# EAGLE design placa_nano (EAGLE 7.7.0)
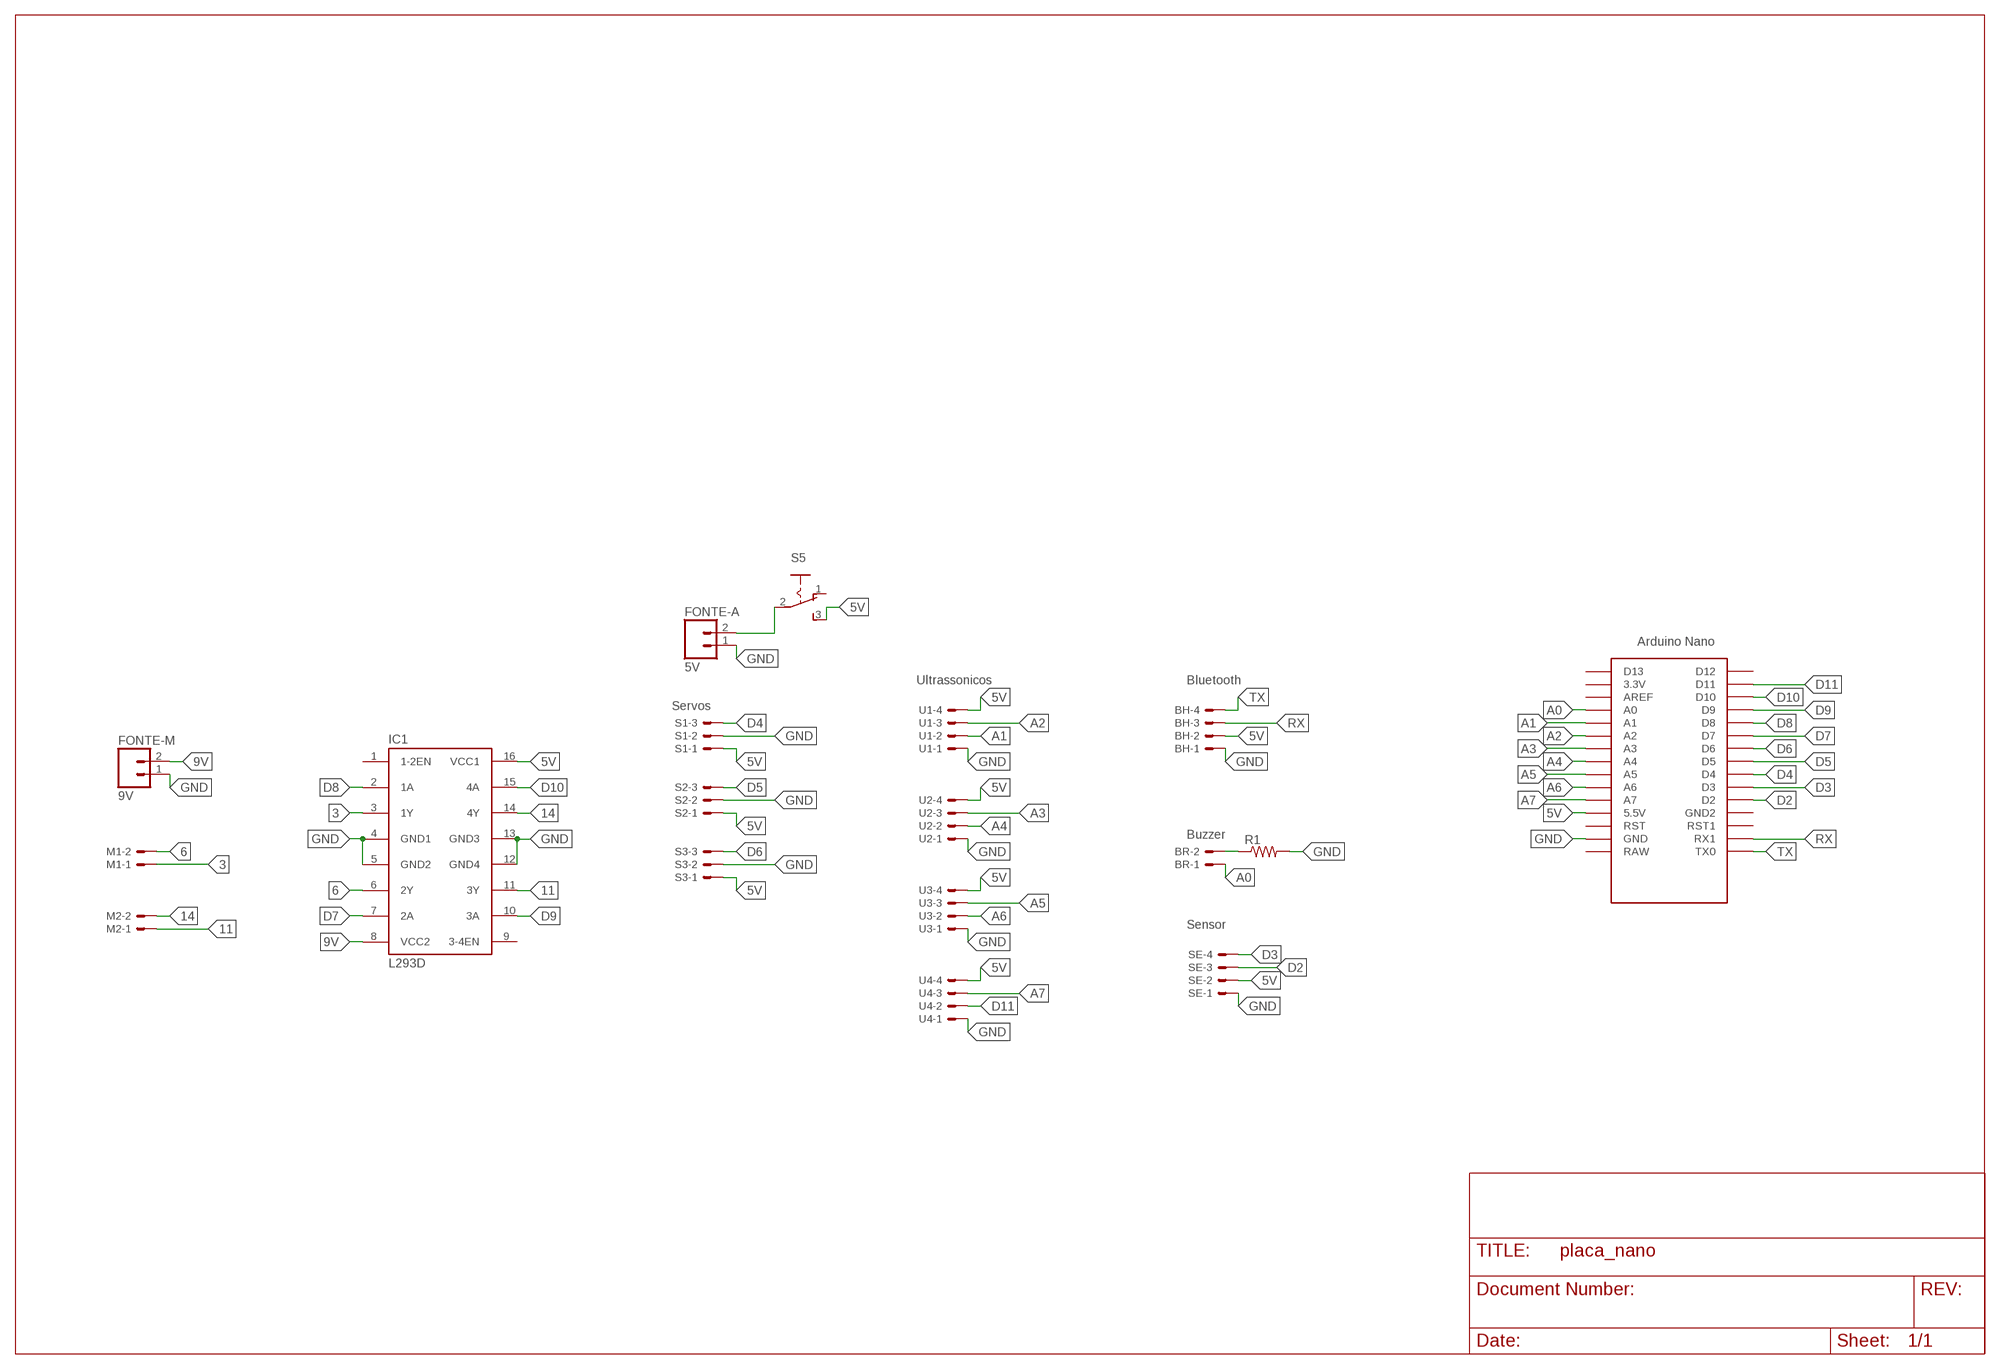
[diagram p0: schematic, sheet 1]

## Parts
BH  22-23-2041  [22-23-2041]
BR  22-23-2021  [22-23-2021]
FONTE-A  5V  M02  [02P]
FONTE-M  9V  M02  [02P]
IC1  L293D  [DIL16]
M1  22-23-2021  [22-23-2021]
M2  22-23-2021  [22-23-2021]
R1  R-US_0207/10  [0207/10]
S1  22-23-2031  [22-23-2031]
S2  22-23-2031  [22-23-2031]
S3  22-23-2031  [22-23-2031]
S5  255SB  [255SB]
SE  22-23-2041  [22-23-2041]
U1  22-23-2041  [22-23-2041]
U2  22-23-2041  [22-23-2041]
U3  22-23-2041  [22-23-2041]
U4  22-23-2041  [22-23-2041]
U$1  NANO  [NANO]

## Nets
3: IC1.3(1Y) M1.1
5V: BH.2 FONTE-A.2 IC1.16(VCC1) S1.1 S2.1 S3.1 S5.2(P) S5.3(S) SE.2 U1.4 U2.4 U3.4 U4.4 U$1.5V(5.5V)
6: IC1.6(2Y) M1.2
9V: FONTE-M.2 IC1.8(VCC2)
11: IC1.11(3Y) M2.1
14: IC1.14(4Y) M2.2
A0: BR.1 U$1.A0
A1: U1.2 U$1.A1
A2: U1.3 U$1.A2
A3: U2.3 U$1.A3
A4: U2.2 U$1.A4
A5: U3.3 U$1.A5
A6: U3.2 U$1.A6
A7: U4.3 U$1.A7
D2: SE.3 U$1.D2
D3: SE.4 U$1.D3
D4: S1.3 U$1.D4
D5: S2.3 U$1.D5
D6: S3.3 U$1.D6
D7: IC1.7(2A) U$1.D7
D8: IC1.2(1A) U$1.D8
D9: IC1.10(3A) U$1.D9
D10: IC1.15(4A) U$1.D10
D11: U4.2 U$1.D11
GND: BH.1 FONTE-A.1 FONTE-M.1 IC1.4(GND1) IC1.5(GND2) IC1.12(GND4) IC1.13(GND3) R1.2 S1.2 S2.2 S3.2 SE.1 U1.1 U2.1 U3.1 U4.1 U$1.GND
N$4: BR.2 R1.1
RX: BH.3 U$1.RX1
TX: BH.4 U$1.TX0
Unconnected: IC1.1(1-2EN) IC1.9(3-4EN) S5.1(O) U$1.3.3V U$1.AREF U$1.D12 U$1.D13 U$1.GND1(GND2) U$1.RAW U$1.RST U$1.RST1

## Notes on the sheet
- Ultrassonicos | Bluetooth
- Servos
- Buzzer
- Sensor

## Library data of the parts
BH SE U1-U4 = con-molex:22-23-2041: .100" (2.54mm) Center Header - 4 Pin; MF: MOLEX; MPN: 22-23-2041; OC_FARNELL: 1462920; OC_NEWARK: 38C0355
BR M1 M2 = con-molex:22-23-2021: .100" (2.54mm) Center Header - 2 Pin; MF: MOLEX; MPN: 22-23-2021; OC_FARNELL: 1462926; OC_NEWARK: 25C3832
FONTE-A FONTE-M = con-amp-quick:M02: AMP QUICK CONNECTOR; OC_FARNELL: unknown; OC_NEWARK: unknown
IC1 = st-microelectronics:L293D: PUSH-PULL 4 CHANNEL DRIVER; MPN: L293D; OC_FARNELL: 9589619; OC_NEWARK: 56P8249
R1 = resistor:R-US_: RESISTOR, American symbol
S1-S3 = con-molex:22-23-2031: .100" (2.54mm) Center Header - 3 Pin; MF: MOLEX; MPN: 22-23-2031; OC_FARNELL: 1462950; OC_NEWARK: 30C0862
S5 = switch:255SB: SLIDING SWITCH Distributor Buerklin, 11G810
U$1 = Arduino-clone:NANO: Arduino Nano

## Board
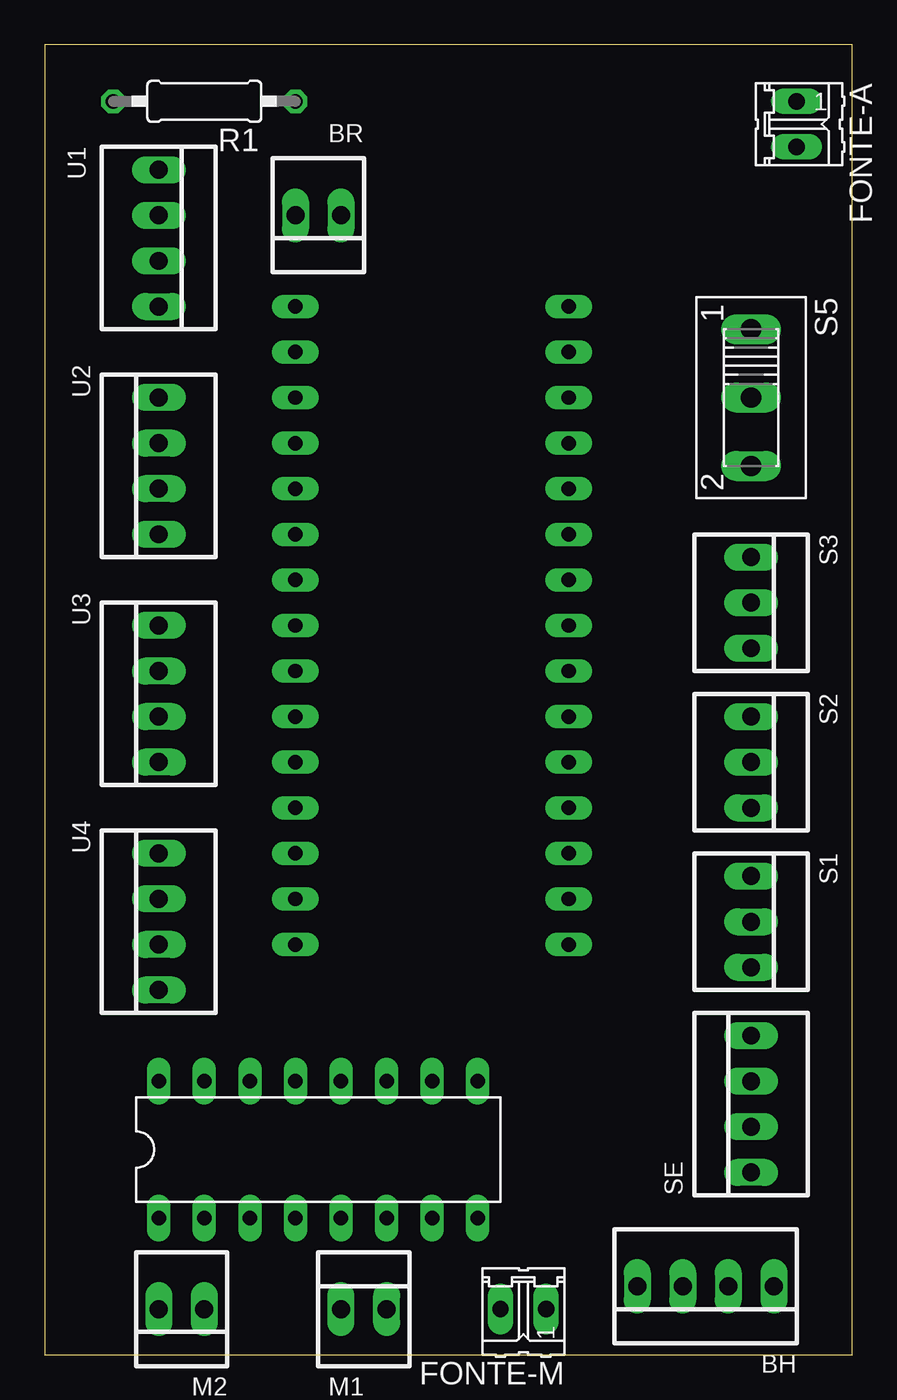
[diagram p1: board, top side]
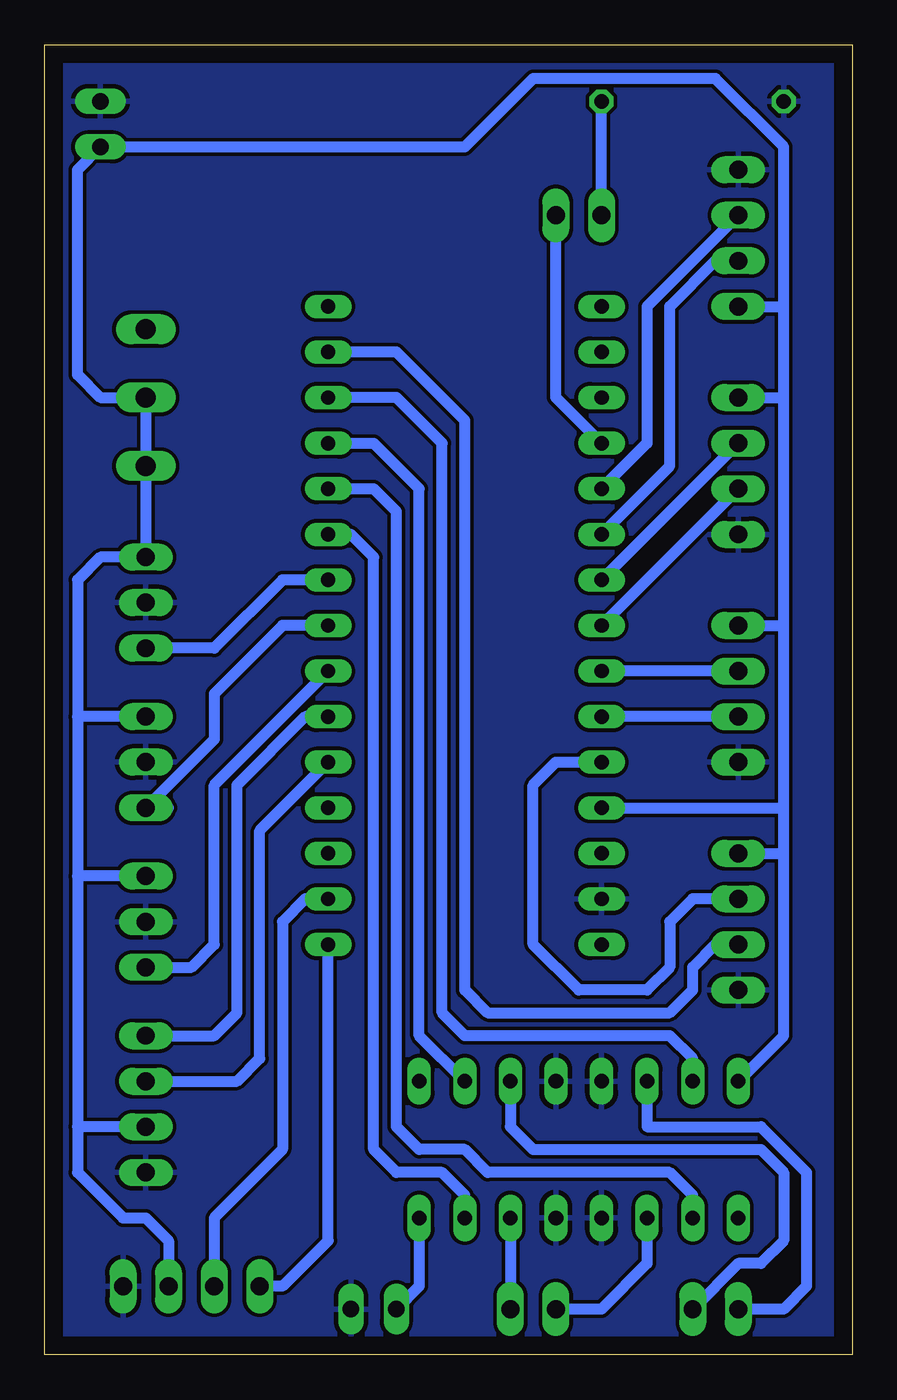
[diagram p2: board, bottom side, seen from below]

Size 45 x 73 mm. Coordinates in mm from the lower left corner, seen from the top.
Outline: 0,0 45,0 45,73 0,73 0,0
Copper layers (1*16): Top 0.035mm / dielectric 1.5mm / Bottom 0.035mm
Design rules "default": minimum track width 10mil, minimum drill 24mil, track to track 8mil, track to pad 8mil, pad to pad 8mil, via to via 8mil, smd to smd 8mil, copper to edge 40mil, drill to drill 8mil, minimum pad ring 10mil, minimum via ring 8mil, stop-mask expansion 4mil, vias tented up to drill 0mil, thermal gap 10mil

### Footprints (pad centres in the part's own frame; a part is rotated, then mirrored left to right if it is on the bottom)
22-23-2041 = drill 1 long: 1 -3.81,0; 2 -1.27,0; 3 1.27,0; 4 3.81,0
22-23-2021 = drill 1 long: 1 -1.27,0; 2 1.27,0
02P = drill 0.914 long: 1 -1.27,0; 2 1.27,0
DIL16 = drill 0.813 long: 1 -8.89,-3.81; 2 -6.35,-3.81; 3 -3.81,-3.81; 4 -1.27,-3.81; 5 1.27,-3.81; 6 3.81,-3.81; 7 6.35,-3.81; 8 8.89,-3.81; 9 8.89,3.81; 10 6.35,3.81; 11 3.81,3.81; 12 1.27,3.81; 13 -1.27,3.81; 14 -3.81,3.81; 15 -6.35,3.81; 16 -8.89,3.81
0207/10 = drill 0.813 octagon: 1 -5.08,0; 2 5.08,0
22-23-2031 = drill 1 long: 1 -2.54,0; 2 0,0; 3 2.54,0
255SB = drill 1.118 long: 1 -3.81,0; 2 0,0; 3 3.81,0
NANO = drill 0.8 long: 3.3V -10.16,24.13; 5V -10.16,-1.27; A0 -10.16,19.05; A1 -10.16,16.51; A2 -10.16,13.97; A3 -10.16,11.43; A4 -10.16,8.89; A5 -10.16,6.35; A6 -10.16,3.81; A7 -10.16,1.27; AREF -10.16,21.59; D2 5.08,1.27; D3 5.08,3.81; D4 5.08,6.35; D5 5.08,8.89; D6 5.08,11.43; D7 5.08,13.97; D8 5.08,16.51; D9 5.08,19.05; D10 5.08,21.59; D11 5.08,24.13; D12 5.08,26.67; D13 -10.16,26.67; GND -10.16,-6.35; GND1 5.08,-1.27; RAW -10.16,-8.89; RST -10.16,-3.81; RST1 5.08,-3.81; RX1 5.08,-6.35; TX0 5.08,-8.89

### Placement (x,y rotation side)
BH  36.83,3.81 180 top
BR  15.24,63.5 180 top
FONTE-A  41.91,68.58 270 top
FONTE-M  26.67,2.54 180 top
IC1  15.24,11.43 0 top
M1  17.78,2.54 0 top
M2  7.62,2.54 180 top
R1  8.89,69.85 180 top
S1  39.37,24.13 270 top
S2  39.37,33.02 270 top
S3  39.37,41.91 270 top
S5  39.37,53.34 270 top
SE  39.37,13.97 90 top
U1  6.35,62.23 270 top
U2  6.35,49.53 90 top
U3  6.35,36.83 90 top
U4  6.35,24.13 90 top
U$1  24.13,31.75 0 top

### Tracks (layer width: path | path; a pad name or v marks a point on that pad's centre or on a via)
3
  Bottom 0.61: IC1.3 11.43,5.08 13.97,2.54 M1.1
5V
  Bottom 0.61: 43.18,35.56 43.18,43.18 41.91,44.45 S3.1 S5.3 S5.2 41.91,53.34 43.18,54.61 43.18,66.04 FONTE-A.2 21.59,67.31 17.78,71.12 7.62,71.12 3.81,67.31 3.81,58.42 | 43.18,35.56 43.18,26.67 | 43.18,26.67 43.18,12.7 | S2.1 43.18,35.56 | S1.1 43.18,26.67 | SE.2 43.18,12.7 | 43.18,12.7 43.18,10.16 40.64,7.62 39.37,7.62 38.1,6.35 BH.2 | IC1.16 3.81,17.78 3.81,27.94 | 3.81,27.94 3.81,30.48 | 3.81,30.48 3.81,40.64 | 3.81,40.64 3.81,53.34 | 3.81,53.34 3.81,58.42 | U1.4 3.81,58.42 | U2.4 3.81,53.34 | U3.4 3.81,40.64 | U4.4 3.81,27.94 | U$1.5V 3.81,30.48
6
  Bottom 0.61: IC1.6 M1.2
9V
  Bottom 0.61: IC1.8 24.13,3.81 FONTE-M.2
11
  Bottom 0.61: IC1.11 19.05,12.7 17.78,11.43 5.08,11.43 3.81,10.16 3.81,6.35 5.08,5.08 6.35,5.08 M2.1
14
  Bottom 0.61: IC1.14 11.43,12.7 5.08,12.7 2.54,10.16 2.54,3.81 3.81,2.54 M2.2
A0
  Bottom 0.61: U$1.A0 16.51,53.34 BR.1
A1
  Bottom 0.61: U1.2 11.43,58.42 11.43,50.8 U$1.A1
A2
  Bottom 0.61: U$1.A2 10.16,49.53 10.16,58.42 7.62,60.96 U1.3
A3
  Bottom 0.61: U$1.A3 U2.3
A4
  Bottom 0.61: U$1.A4 U2.2
A5
  Bottom 0.61: U3.3 U$1.A5
A6
  Bottom 0.61: U3.2 U$1.A6
A7
  Bottom 0.61: U$1.A7 16.51,33.02 17.78,31.75 17.78,22.86 15.24,20.32 11.43,20.32 10.16,21.59 10.16,24.13 8.89,25.4 U4.3
D2
  Bottom 0.61: SE.3 34.29,15.24 33.02,16.51 33.02,29.21 U$1.D2
D3
  Bottom 0.61: SE.4 35.56,17.78 34.29,19.05 34.29,31.75 30.48,35.56 U$1.D3
D4
  Bottom 0.61: S1.3 36.83,21.59 35.56,22.86 35.56,31.75 U$1.D4
D5
  Bottom 0.61: 38.1,30.48 S2.3 35.56,34.29 35.56,36.83 31.75,40.64 U$1.D5
D6
  Bottom 0.61: U$1.D6 31.75,43.18 35.56,39.37 S3.3
D7
  Bottom 0.61: IC1.7 21.59,8.89 22.86,10.16 25.4,10.16 26.67,11.43 26.67,44.45 27.94,45.72 U$1.D7
D8
  Bottom 0.61: IC1.2 8.89,8.89 10.16,10.16 20.32,10.16 21.59,11.43 24.13,11.43 25.4,12.7 25.4,46.99 26.67,48.26 U$1.D8
D9
  Bottom 0.61: U$1.D9 26.67,50.8 24.13,48.26 24.13,17.78 IC1.10
D10
  Bottom 0.61: IC1.15 8.89,16.51 10.16,17.78 21.59,17.78 22.86,19.05 22.86,50.8 25.4,53.34 U$1.D10
D11
  Bottom 0.61: U4.2 7.62,22.86 8.89,21.59 8.89,20.32 10.16,19.05 20.32,19.05 21.59,20.32 21.59,52.07 25.4,55.88 U$1.D11
GND
  pour Bottom: 0,0 45.09,0 45.09,73.03 0,73.03
N$4
  Bottom 0.61: BR.2 R1.1
RX
  Bottom 0.61: BH.3 35.56,7.62 31.75,11.43 31.75,24.13 30.48,25.4 U$1.RX1
TX
  Bottom 0.61: BH.4 31.75,3.81 29.21,6.35 U$1.TX0